# EAGLE design LED-RGB-shield_v1.1 (EAGLE 5.07)

## Sheet 1 of 2
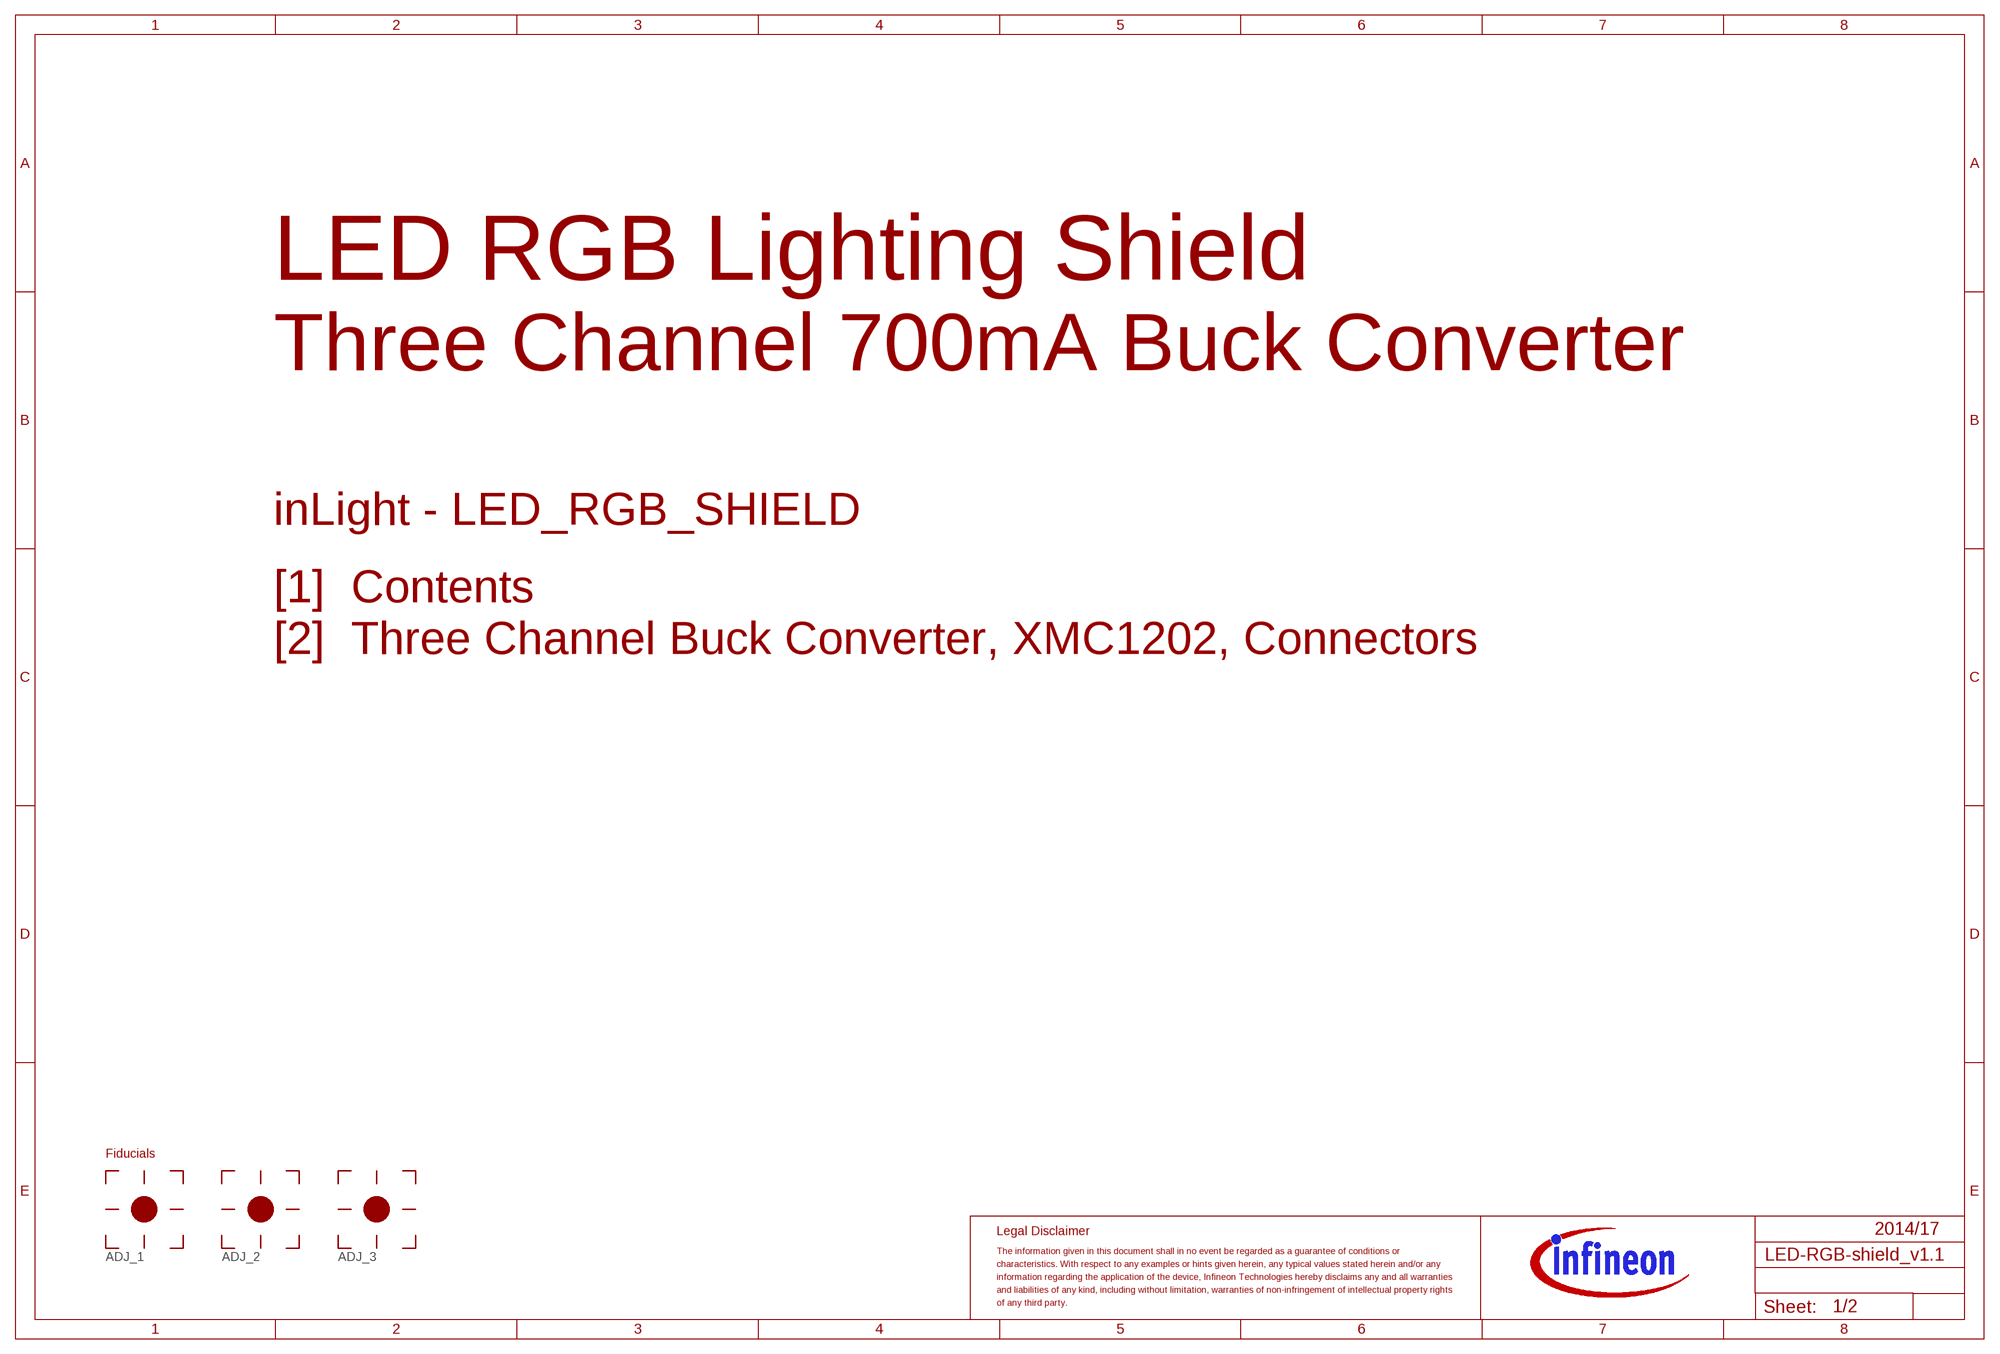
[diagram p0: schematic, sheet 1]

### Parts
ADJ_1  FIDUCIAL  [FIDUCIAL]
ADJ_2  FIDUCIAL  [FIDUCIAL]
ADJ_3  FIDUCIAL  [FIDUCIAL]
U1  INFINEONI3  [INFINEON_ICON_3]

### Notes on the sheet
- LED RGB Lighting Shield
- Three Channel 700mA Buck Converter
- inLight - LED_RGB_SHIELD
- [1]  Contents
- [2]  Three Channel Buck Converter, XMC1202, Connectors
- Fiducials
- 2014/17

## Sheet 2 of 2
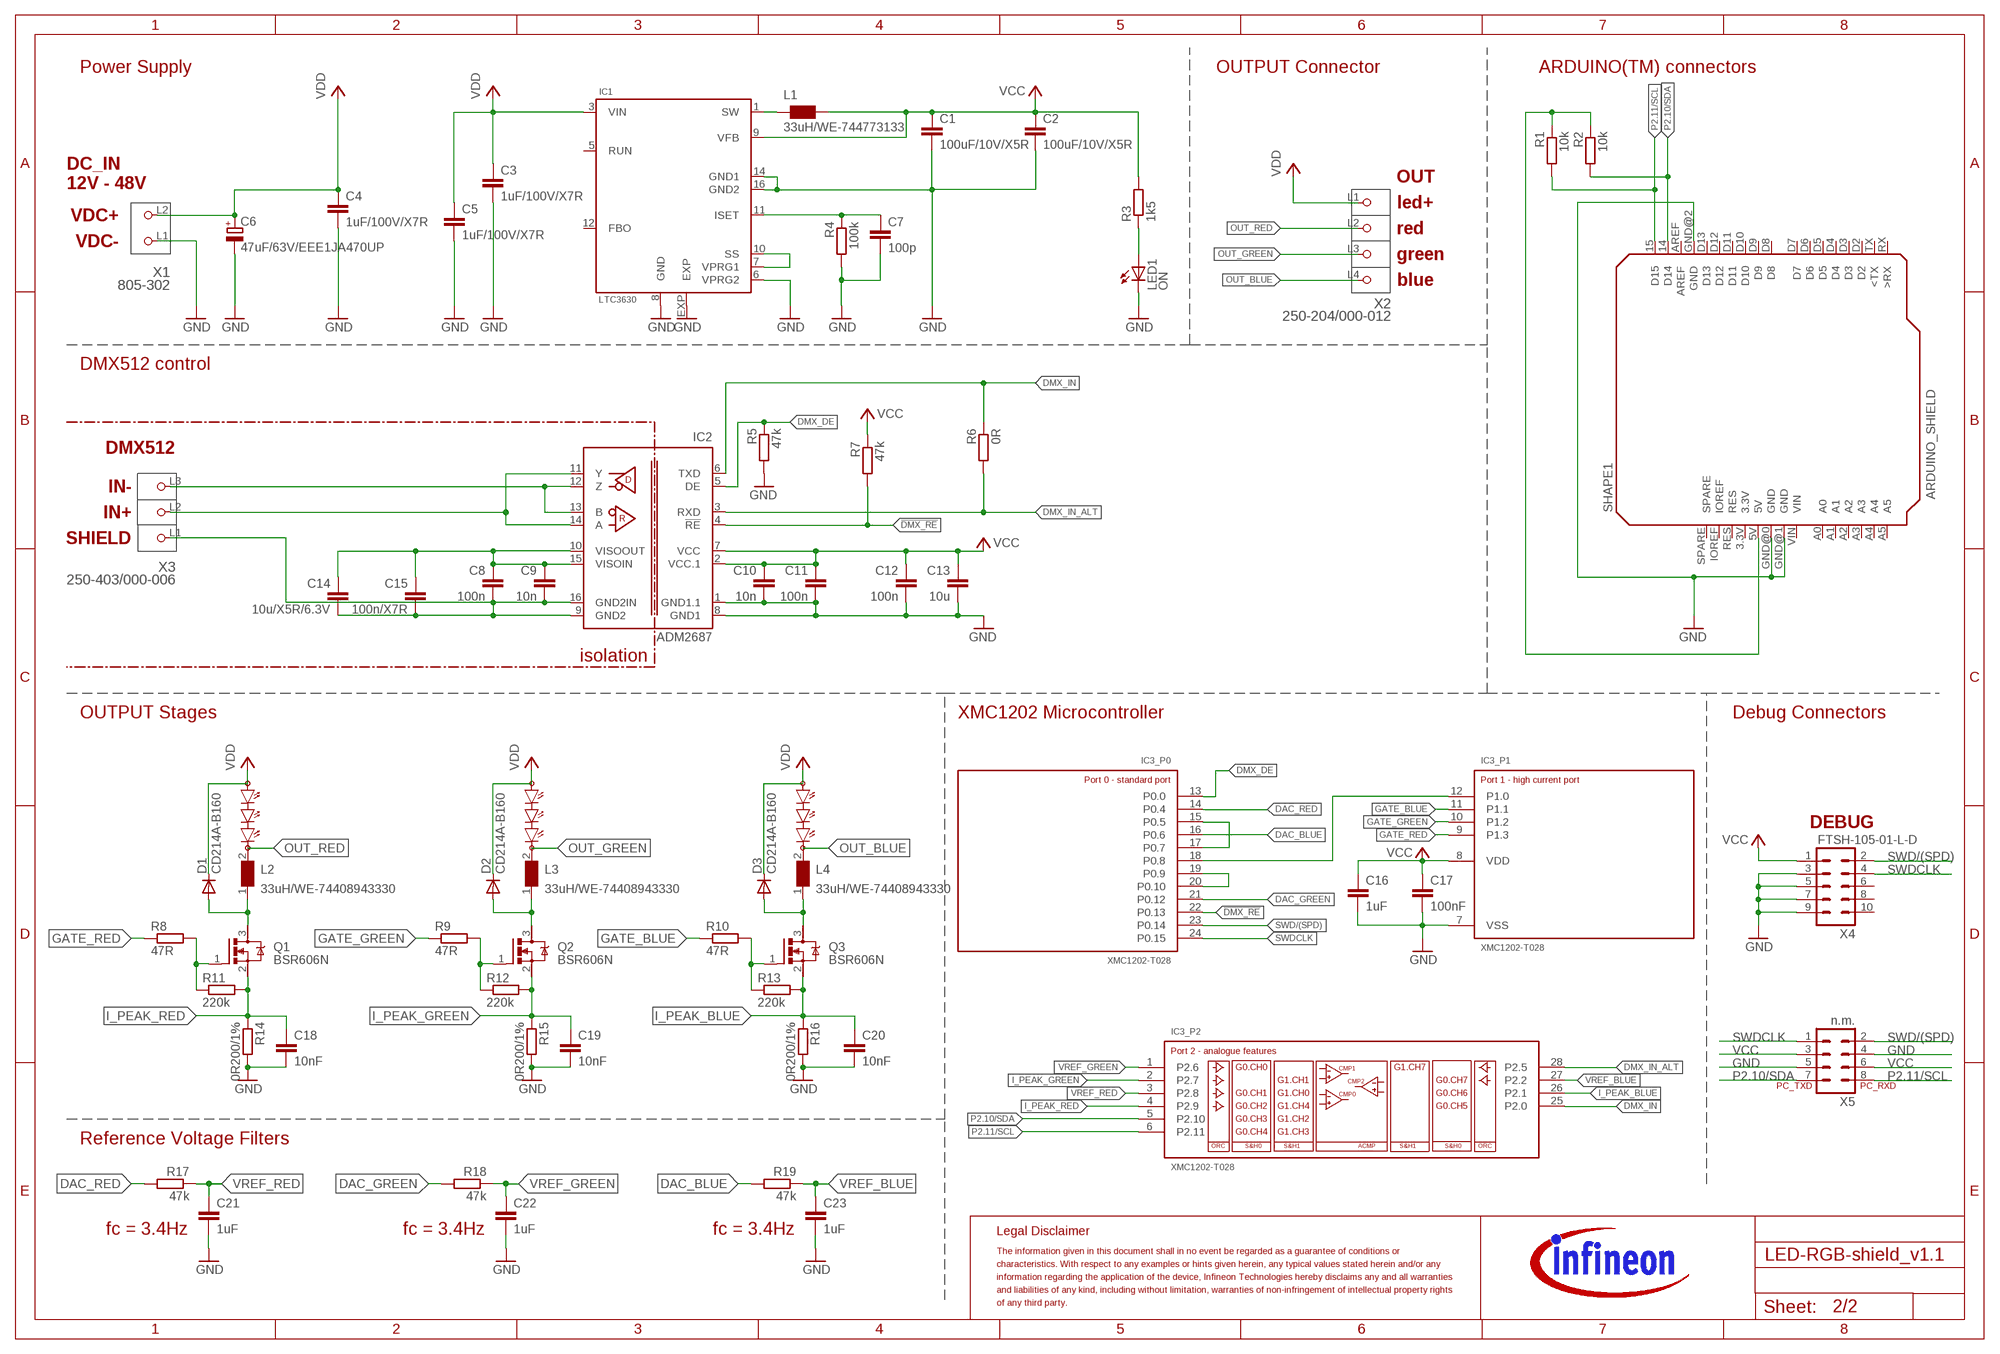
[diagram p1: schematic, sheet 2]

### Parts
C1  100uF/10V/X5R  C-EUC1206  [C1206]
C2  100uF/10V/X5R  C-EUC1206  [C1206]
C3  1uF/100V/X7R  C-EUC1206  [C1206]
C4  1uF/100V/X7R  C-EUC1206  [C1206]
C5  1uF/100V/X7R  C-EUC1206  [C1206]
C6  47uF/63V/EEE1JA470UP  CPOL-EUF  [PANASONIC_F]
C7  100p  C-EUC0603  [C0603]
C8  100n  C-EUC0603  [C0603]
C9  10n  C-EUC0603  [C0603]
C10  10n  C-EUC0603  [C0603]
C11  100n  C-EUC0603  [C0603]
C12  100n  C-EUC0603  [C0603]
C13  10u  C-EUC0603  [C0603]
C14  10u/X5R/6.3V  C-EUC0603  [C0603]
C15  100n/X7R  C-EUC0603  [C0603]
C16  1uF  C-EUC0603  [C0603]
C17  100nF  C-EUC0603  [C0603]
C18  10nF  C-EUC0603  [C0603]
C19  10nF  C-EUC0603  [C0603]
C20  10nF  C-EUC0603  [C0603]
C21  1uF  C-EUC0603  [C0603]
C22  1uF  C-EUC0603  [C0603]
C23  1uF  C-EUC0603  [C0603]
D1  CD214A-B160  DIODE-DO-214AC  [DO-214AC]
D2  CD214A-B160  DIODE-DO-214AC  [DO-214AC]
D3  CD214A-B160  DIODE-DO-214AC  [DO-214AC]
IC1  LTC3630  [MSE16(12)]
IC2  ADM2687  [SO-16W]
IC3  XMC1202-T028  XMC1000-T028  [P-TSSOP28-16]
L1  33uH/WE-744773133  WE-PD2_S  [WE-PD2_S]
L2  33uH/WE-74408943330  WE-SPC_48XX_4838/4828/4818  [WE-SPC_48XX]
L3  33uH/WE-74408943330  WE-SPC_48XX_4838/4828/4818  [WE-SPC_48XX]
L4  33uH/WE-74408943330  WE-SPC_48XX_4838/4828/4818  [WE-SPC_48XX]
LED1  ON  LEDCHIP-LED0603  [CHIP-LED0603]
Q1  BSR606N  [SC59]
Q2  BSR606N  [SC59]
Q3  BSR606N  [SC59]
R1  10k  R-EU_R0603  [R0603]
R2  10k  R-EU_R0603  [R0603]
R3  1k5  R-EU_R0603  [R0603]
R4  100k  R-EU_R0603  [R0603]
R5  47k  R-EU_R0603  [R0603]
R6  0R  R-EU_R0603  [R0603]
R7  47k  R-EU_R0603  [R0603]
R8  47R  R-EU_R0603  [R0603]
R9  47R  R-EU_R0603  [R0603]
R10  47R  R-EU_R0603  [R0603]
R11  220k  R-EU_R0603  [R0603]
R12  220k  R-EU_R0603  [R0603]
R13  220k  R-EU_R0603  [R0603]
R14  0R200/1%  R-EU_R0805  [R0805]
R15  0R200/1%  R-EU_R0805  [R0805]
R16  0R200/1%  R-EU_R0805  [R0805]
R17  47k  R-EU_R0603  [R0603]
R18  47k  R-EU_R0603  [R0603]
R19  47k  R-EU_R0603  [R0603]
SHAPE1  ARDUINO_SHIELD  [XMC1100_FOR_ARDUINO]
U2  INFINEONS5  [INFINEON_LOGO_5_SILK]
X1  805-302  [P-805-302]
X2  250-204/000-012  [P-250-204]
X3  250-403/000-006  [P-250-403]
X4  FTSH-105-01-L-D  FTSH-105-01-L-DV-THROUGHHOLE  [FTSH-105-01-L-DV-THROUGHHOLE]
X5  n.m.  MA04-2  [MA04-2]

### Nets
!DMX_RE: IC2.4(!RE) IC3.22(_P0:P0.13) R7.2
DAC_BLUE: IC3.16(_P0:P0.6) R19.2
DAC_GREEN: IC3.21(_P0:P0.12) R18.2
DAC_RED: IC3.14(_P0:P0.4) R17.2
DMX_DE: IC2.5(DE) IC3.13(_P0:P0.0) R5.1
DMX_IN: IC2.6(TXD) IC3.25(_P2:P2.0) R6.1
DMX_IN_ALT: IC2.3(RXD) IC3.28(_P2:P2.5) R6.2
GATE_BLUE: IC3.11(_P1:P1.1) R10.1
GATE_GREEN: IC3.10(_P1:P1.2) R9.1
GATE_RED: IC3.9(_P1:P1.3) R8.1
GND: C1.2 C2.2 C3.2 C4.2 C5.2 C6.- C7.2 C10.2 C11.2 C12.2 C13.2 C16.2 C17.2 C18.2 C19.2 C20.2 C21.2 C22.2 C23.2 IC1.6(VPRG2) IC1.8(GND) IC1.14(GND1) IC1.16(GND2) IC1.EXP IC2.1(GND1.1) IC2.8(GND1) IC3.7(_P1:VSS) LED1.C R4.2 R5.2 R14.2 R15.2 R16.2 SHAPE1.GND@0(GND) SHAPE1.GND@1(GND) SHAPE1.GND@2(GND) X1.L1(P1) X4.3 X4.5 X4.7 X4.9 X5.4 X5.5
I_PEAK_BLUE: C20.1 IC3.26(_P2:P2.1) Q3.2(S) R13.2 R16.1
I_PEAK_GREEN: C19.1 IC3.2(_P2:P2.7) Q2.2(S) R12.2 R15.1
I_PEAK_RED: C18.1 IC3.4(_P2:P2.9) Q1.2(S) R11.2 R14.1
N$1: D2.A L3.1 Q2.3(D)
N$2: D1.A L2.1 Q1.3(D)
N$3: IC3.15(_P0:P0.5) IC3.17(_P0:P0.7)
N$4: D3.A L4.1 Q3.3(D)
N$5: IC3.12(_P1:P1.0) IC3.18(_P0:P0.8)
N$6: IC3.19(_P0:P0.9) IC3.20(_P0:P0.10)
N$7: IC2.12(Z) IC2.13(B) X3.L3(P3)
N$8: IC2.11(Y) IC2.14(A) X3.L2(P2)
N$9: R1.1 R2.1 SHAPE1.5V
N$10: IC1.1(SW) L1.2
N$11: LED1.A R3.1
N$12: C8.1 C9.1 C14.1 C15.1 IC2.10(VISOOUT) IC2.15(VISOIN)
N$13: C7.1 IC1.11(ISET) R4.1
N$14: Q1.1(G) R8.2 R11.1
N$15: IC1.7(VPRG1) IC1.10(SS)
N$16: Q3.1(G) R10.2 R13.1
N$17: Q2.1(G) R9.2 R12.1
OUT_BLUE: L4.2 X2.L4(P4)
OUT_GREEN: L3.2 X2.L3(P3)
OUT_RED: L2.2 X2.L2(P2)
P2.10/SDA: IC3.5(_P2:P2.10) R2.2 SHAPE1.14(D14) X5.7
P2.11/SCL: IC3.6(_P2:P2.11) R1.2 SHAPE1.15(D15) X5.8
SHIELD: C8.2 C9.2 C14.2 C15.2 IC2.9(GND2) IC2.16(GND2IN) X3.L1(P1)
SWD/(SPD): IC3.23(_P0:P0.14) X4.2 X5.2
SWDCLK: IC3.24(_P0:P0.15) X4.4 X5.1
VCC: C1.1 C2.1 C10.1 C11.1 C12.1 C13.1 C16.1 C17.1 IC1.9(VFB) IC2.2(VCC.1) IC2.7(VCC) IC3.8(_P1:VDD) L1.1 R3.2 R7.1 X4.1 X5.3 X5.6
VDD: C3.1 C4.1 C5.1 C6.+ D1.C D2.C D3.C IC1.3(VIN) X1.L2(P2) X2.L1(P1)
VREF_BLUE: C23.1 IC3.27(_P2:P2.2) R19.1
VREF_GREEN: C22.1 IC3.1(_P2:P2.6) R18.1
VREF_RED: C21.1 IC3.3(_P2:P2.8) R17.1
Unconnected: SHAPE1.3.3V SHAPE1.A0 SHAPE1.A1 SHAPE1.A2 SHAPE1.A3 SHAPE1.A4 SHAPE1.A5 SHAPE1.AREF SHAPE1.D2 SHAPE1.D3 SHAPE1.D4 SHAPE1.D5 SHAPE1.D6 SHAPE1.D7 SHAPE1.D8 SHAPE1.D9 SHAPE1.D10 SHAPE1.D11 SHAPE1.D12 SHAPE1.D13 SHAPE1.IOREF SHAPE1.RES SHAPE1.RX(>RX) SHAPE1.SPARE SHAPE1.TX(<TX) SHAPE1.VIN X4.6 X4.8 X4.10

### Notes on the sheet
- Power Supply | OUTPUT Connector | ARDUINO(TM) connectors
- DC_IN
- OUT
- 12V - 48V
- VDC+ | led+
- VDC- | red
- green
- blue
- DMX512 control
- DMX512
- IN-
- IN+
- SHIELD
- isolation
- OUTPUT Stages | XMC1202 Microcontroller | Debug Connectors
- DEBUG
- PC_TXD | PC_RXD
- Reference Voltage Filters
- fc = 3.4Hz | fc = 3.4Hz | fc = 3.4Hz

## Power pins joined to a net without a drawn wire
FBO: IC1.12(FBO)
RUN: IC1.5(RUN)

## Library data of the parts
ADJ_1-ADJ_3 = Global:FIDUCIAL: Fiducial FIDUCIAL: Durchmesser = 0.75mm Kupfer und 1.5mm Lötstopmaske FIDUCIAL 0.5mm: Durchmesser= 0.5mm Kupfer und 1.0mm Lötstopmaske
C1-C5 C7-C23 = rcl:C-EU: CAPACITOR, European symbol
C6 = rcl:CPOL-EU: POLARIZED CAPACITOR, European symbol
D1-D3 = diode:DIODE-: DIODE
IC1 = LinearTechnology:LTC3630
IC2 = AnalogDevice:ADM2687: Triple-Channel Digital Isolators Source: http://www.analog.com/static/imported-files/data_sheets/ADuM1300_1301.pdf
IC3 = XMC1000:XMC1000-T028
L1 = wuerth-elektronik:WE-PD2: SMD-Power Inductors WE-PD2 Is recommended for the application with switching regulators from National Semiconductor, Linear Technology, Texas Instruments and Fairchild Semiconductor -- Switching regulators with low operating voltages (computer, laptop, mobile phones, pagers) -- Integrated DC/DC-converter
L2-L4 = PowerMagnetics:WE-SPC_48XX: SMD-Shielded Power Inductor WE-SPC
LED1 = led:LED: LED OSRAM: - CHIPLED LG R971, LG N971, LY N971, LG Q971, LY Q971, LO R971, LY R971 LH N974, LH R974 LS Q976, LO Q976, LY Q976 LO Q996 - Hyper CHIPLED LW Q18S LB Q993, LB Q99A, LB R99A - SideLED LS A670, LO A670, LY A670, LG A670, LP A670 LB A673, LV A673, LT A673, LW A673 LH A674 LY A675 LS A676, LA A676, LO A676, LY A676, LW A676 LS A679, LY A679, LG A679 - Hyper Micro SIDELED® LS Y876, LA Y876, LO Y876, LY Y876 LT Y87S - SmartLED LW L88C, LW L88S LB L89C, LB L89S, LG L890 LS L89K, LO L89K, LY L89K LS L896, LA L896, LO L896, LY L896 - TOPLED LS T670, LO T670, LY T670, LG T670, LP T670 LSG T670, LSP T670, LSY T670, LOP T670, LYG T670 LG T671, LOG T671, LSG T671 LB T673, LV T673, LT T673, LW T673 LH T674 LS T676, LA T676, LO T676, LY T676, LB T676, LH T676, LSB T676, LW T676 LB T67C, LV T67C, LT T67C, LS T67K, LO T67K, LY T67K, LW E67C LS E67B, LA E67B, LO E67B, LY E67B, LB E67C, LV E67C, LT E67C LW T67C LS T679, LY T679, LG T679 LS T770, LO T770, LY T770, LG T770, LP T770 LB T773, LV T773, LT T773, LW T773 LH T774 LS E675, LA E675, LY E675, LS T675 LS T776, LA T776, LO T776, LY T776, LB T776 LHGB T686 LT T68C, LB T68C - Hyper Mini TOPLED® LB M676 - Mini TOPLED Santana® LG M470 LS M47K, LO M47K, LY M47K Source: http://www.osram.convergy.de LUXEON: - LUMILED® LXK2-PW12-R00, LXK2-PW12-S00, LXK2-PW14-U00, LXK2-PW14-V00 LXK2-PM12-R00, LXK2-PM12-S00, LXK2-PM14-U00 LXK2-PE12-Q00, LXK2-PE12-R00, LXK2-PE12-S00, LXK2-PE14-T00, LXK2-PE14-U00 LXK2-PB12-K00, LXK2-PB12-L00, LXK2-PB12-M00, LXK2-PB14-N00, LXK2-PB14-P00, LXK2-PB14-Q00 LXK2-PR12-L00, LXK2-PR12-M00, LXK2-PR14-Q00, LXK2-PR14-R00 LXK2-PD12-Q00, LXK2-PD12-R00, LXK2-PD12-S00 LXK2-PH12-R00, LXK2-PH12-S00 LXK2-PL12-P00, LXK2-PL12-Q00, LXK2-PL12-R00 Source: www.luxeon.com KINGBRIGHT: KA-3528ASYC Source: www.kingbright.com
Q1-Q3 = infineon_discrete:BSR606N
R1-R19 = rcl:R-EU_: RESISTOR, European symbol
SHAPE1 = arduino:ARDUINO_SHIELD
U1 U2 = infineon_logo:INFINEON
X1 = con-wago_805:805-302: Serie 805, Klemmenleiste für Leiterplatten 1 Lötstift/Pol versetzt / Series 805, PCB terminal strip 1 solder pin/pole, staggered Polzahl / Pole No.: 2 Bemessungsspannung / Rated Voltage: 320 V Nennstrom / Nominal Current: 17.5 A Leiterquerschnitt / Conductor Size: 0.2 - 1.5 mm² Anschlusstechnik / Connection Technology: CAGE CLAMP® S Lötstiftlänge: / Solder Pin Length: 3.2 mm Leitereinführung (zur Platine) / Conductor entry angle (to PCB): 0 ° Farbe / Color: grau / gray Stand: 01.01.2012. Die jeweils aktuellen Daten zu diesem Artikel finden Sie in unserem Produktkatalog, den Sie unter www.wago.com einsehen können. As of: 01/01/2012. Please find the newest data for this article in our product catalogue, which can be viewed under www.wago.com.
X2 = con-wago_250:250-204/000-012: Serie 250, 1-Leiter-Klemmenleiste für Leiterplatten 1 Lötstift/Pol versetzt / Series 250, 1-conductor PCB terminal strip 1 solder pin/pole, staggered Polzahl / Pole No.: 4 Rastermaß / Pitch: 3.5 mm Bemessungsspannung / Rated Voltage: 320 V Nennstrom / Nominal Current: 8 A Leiterquerschnitt / Conductor Size: 0.2 - 1.5 mm² Anschlusstechnik / Connection Technology: Steckklemm-Anschluss Lötstiftlänge: / Solder Pin Length: 3.6 mm Leitereinführung (zur Platine) / Conductor entry angle (to PCB): 45 ° Farbe / Color: orange / orange Stand: 01.01.2012. Die jeweils aktuellen Daten zu diesem Artikel finden Sie in unserem Produktkatalog, den Sie unter www.wago.com einsehen können. As of: 01/01/2012. Please find the newest data for this article in our product catalogue, which can be viewed under www.wago.com.
X3 = con-wago_250:250-403/000-006: Serie 250, 1-Leiter-Klemmenleiste für Leiterplatten 1 Lötstift/Pol versetzt / Series 250, 1-conductor PCB terminal strip 1 solder pin/pole, staggered Polzahl / Pole No.: 3 Rastermaß / Pitch: 2.5 mm Bemessungsspannung / Rated Voltage: 160 V Nennstrom / Nominal Current: 4 A Leiterquerschnitt / Conductor Size: 0.14 - 0.5 mm² Lötstiftlänge: / Solder Pin Length: 3.6 mm Leitereinführung (zur Platine) / Conductor entry angle (to PCB): 45 ° Farbe / Color: blau / blue Stand: 01.01.2012. Die jeweils aktuellen Daten zu diesem Artikel finden Sie in unserem Produktkatalog, den Sie unter www.wago.com einsehen können. As of: 01/01/2012. Please find the newest data for this article in our product catalogue, which can be viewed under www.wago.com.
X4 = TIMM1:FTSH-105-01-L-DV-THROUGHHOLE
X5 = con-lstb:MA04-2: PIN HEADER

## Net classes
1 ground: clearance 0.381 mm
2 Meas_analog: width 0.2 mm, drill 0.2 mm, clearance 2 mm to class 1, clearance 0.2 mm
6 LV: clearance 0.2 mm to class 0, clearance 2 mm to class 1, clearance 0.2 mm to class 2, clearance 2 mm to class 3, clearance 2 mm to class 4, clearance 1 mm to class 5, clearance 0.2 mm

## Board
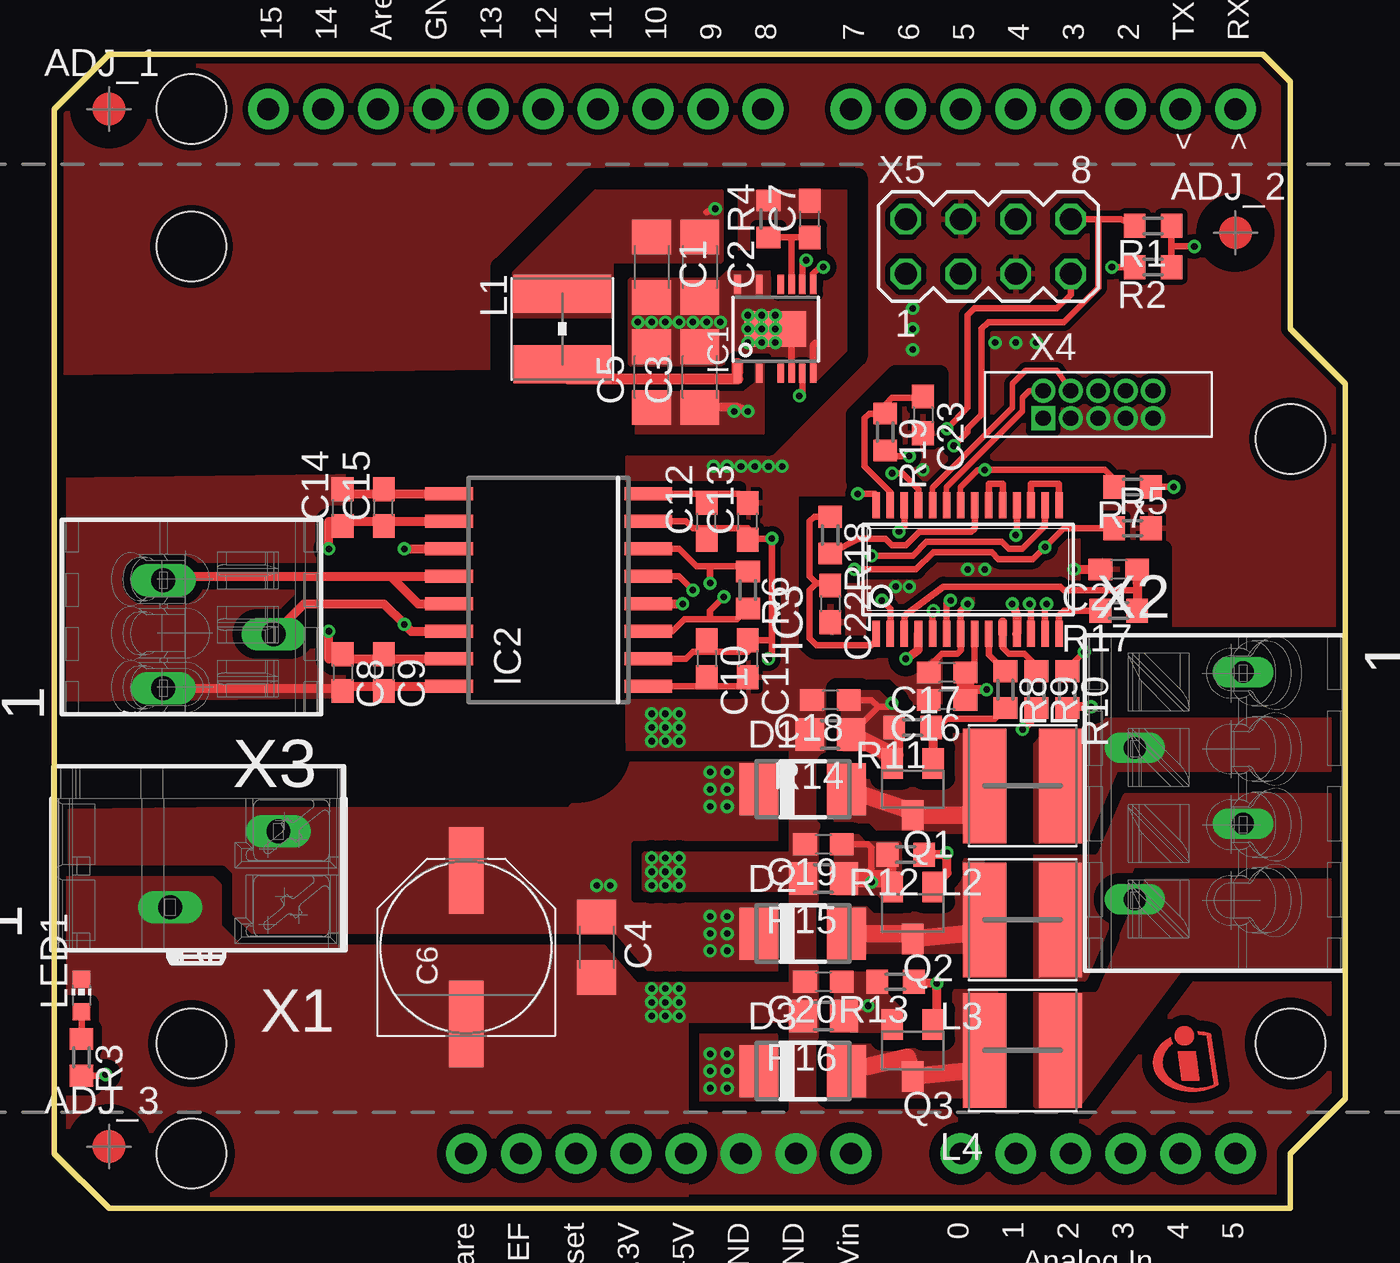
[diagram p2: board, top side]
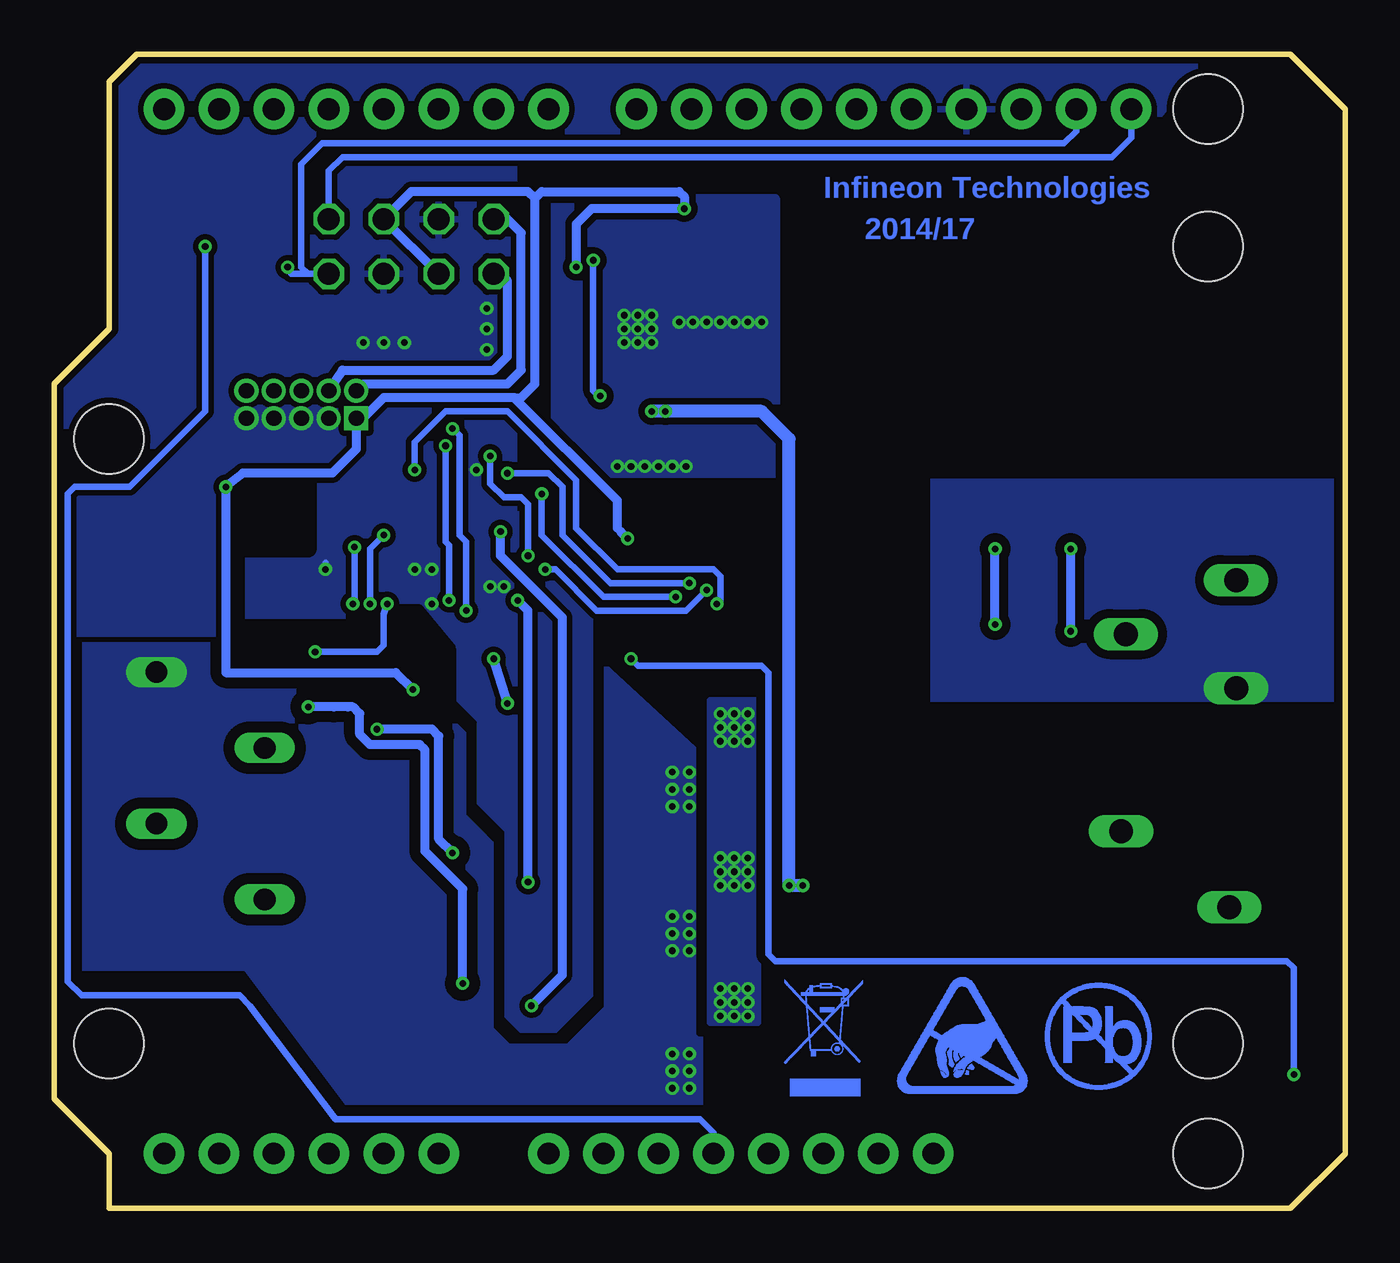
[diagram p3: board, bottom side, seen from below]

Size 59.69 x 53.34 mm. Coordinates in mm from the lower left corner, seen from the top.
Copper layers (1*16): Top 0.035mm / dielectric 1.5mm / Bottom 0.035mm
Design rules "PCB-POOL Standard *": minimum track width 0.15mm, minimum drill 0.3mm, track to track 0.15mm, track to pad 0.15mm, pad to pad 0.15mm, via to via 0.15mm, smd to smd 0.15mm, copper to edge 0.3mm, drill to drill 0.2mm, minimum pad ring 0.2mm, minimum via ring 0.15mm, stop-mask expansion 0.075mm, vias tented up to drill 12mil, thermal gap 0.2mm
Holes 3.2 mm at 6.35,7.62 6.35,44.45
tRestrict: area 26.7,23.8 to 31.8,33.3; 23 lines
bRestrict: 9 lines

### Footprints (pad centres in the part's own frame; a part is rotated, then mirrored left to right if it is on the bottom)
C1206 = smd 1.6 x 1.8: 1 -1.4,0; 2 1.4,0
PANASONIC_F = smd 4 x 1.6: + 3.55,0; - -3.55,0
C0603 = smd 1.1 x 1: 1 -0.85,0; 2 0.85,0
DO-214AC = smd 1.8 x 2.4: A 2.025,0; C -2.025,0
MSE16(12) = smd 0.305 x 0.889: 1 -1.75,-2.05; 3 -0.75,-2.05; 5 0.25,-2.05; 6 0.75,-2.05; 7 1.25,-2.05; 8 1.75,-2.05; 9 1.75,2.05; 10 1.25,2.05; 11 0.75,2.05; 12 0.25,2.05; 14 -0.75,2.05; 16 -1.75,2.05 | smd 2.845 x 1.651: EXP 0,0
SO-16W = smd 0.6 x 2.2: 1 -4.445,-4.6; 2 -3.175,-4.6; 3 -1.905,-4.6; 4 -0.635,-4.6; 5 0.635,-4.6; 6 1.905,-4.6; 7 3.175,-4.6; 8 4.445,-4.6; 9 4.445,4.6; 10 3.175,4.6; 11 1.905,4.6; 12 0.635,4.6; 13 -0.635,4.6; 14 -1.905,4.6; 15 -3.175,4.6; 16 -4.445,4.6
P-TSSOP28-16 = smd 1.2 x 0.35: 1 -2.975,4.225; 2 -2.975,3.575; 3 -2.975,2.925; 4 -2.975,2.275; 5 -2.975,1.625; 6 -2.975,0.975; 7 -2.975,0.325; 8 -2.975,-0.325; 9 -2.975,-0.975; 10 -2.975,-1.625; 11 -2.975,-2.275; 12 -2.975,-2.925; 13 -2.975,-3.575; 14 -2.975,-4.225; 15 2.975,-4.225; 16 2.975,-3.575; 17 2.975,-2.925; 18 2.975,-2.275; 19 2.975,-1.625; 20 2.975,-0.975; 21 2.975,-0.325; 22 2.975,0.325; 23 2.975,0.975; 24 2.975,1.625; 25 2.975,2.275; 26 2.975,2.925; 27 2.975,3.575; 28 2.975,4.225
WE-PD2_S = smd 1.75 x 4.5: 1 -1.625,0; 2 1.625,0
WE-SPC_48XX = smd 2 x 5.3: 1 -1.75,0; 2 1.75,0
CHIP-LED0603 = smd 0.8 x 0.8: A 0,-0.75; C 0,0.75
SC59 = smd 1 x 1.4: 1 -0.95,-1.2; 2 0.95,-1.2; 3 0,1.2
R0603 = smd 1 x 1.1: 1 -0.85,0; 2 0.85,0
R0805 = smd 1.3 x 1.5: 1 -0.95,0; 2 0.95,0
XMC1100_FOR_ARDUINO = drill 1.016 pad 1.88 round: 3.3V 26.67,2.54; 5V 29.21,2.54; 14 12.446,50.8; 15 9.906,50.8; A0 41.91,2.54; A1 44.45,2.54; A2 46.99,2.54; A3 49.53,2.54; A4 52.07,2.54; A5 54.61,2.54; AREF 14.986,50.8; D2 49.53,50.8; D3 46.99,50.8; D4 44.45,50.8; D5 41.91,50.8; D6 39.37,50.8; D7 36.83,50.8; D8 32.766,50.8; D9 30.226,50.8; D10 27.686,50.8; D11 25.146,50.8; D12 22.606,50.8; D13 20.066,50.8; GND@0 31.75,2.54; GND@1 34.29,2.54; GND@2 17.526,50.8; IOREF 21.59,2.54; RES 24.13,2.54; RX 54.61,50.8; SPARE 19.05,2.54; TX 52.07,50.8; VIN 36.83,2.54 | hole 3.2: 57.15,35.56; 57.15,7.62; 6.35,50.8; 6.35,2.54
P-805-302 = drill 1.1 long: L1 1.3,1.95; L2 -3.7,-1.55
P-250-204 = drill 1 long: L1 1.3,6.05; L2 -3.7,2.55; L3 1.3,-0.95; L4 -3.7,-4.45
P-250-403 = drill 1.1 long: L1 1.3,3.271; L2 -3.8,0.771; L3 1.3,-1.729
FTSH-105-01-L-DV-THROUGHHOLE = drill 0.71 pad 0.889 square: 1 0,0 | drill 0.71 pad 0.889 round: 2 0,1.27; 3 1.27,0; 4 1.27,1.27; 5 2.54,0; 7 3.81,0; 8 3.81,1.27; 9 5.08,0; 10 5.08,1.27 | drill 0.7 pad 0.889 round: 6 2.54,1.27
MA04-2 = drill 1.016 octagon: 1 -3.81,-1.27; 2 -3.81,1.27; 3 -1.27,-1.27; 4 -1.27,1.27; 5 1.27,-1.27; 6 1.27,1.27; 7 3.81,-1.27; 8 3.81,1.27

### Placement (x,y rotation side)
ADJ_1  2.54,50.8 0 top
ADJ_2  54.61,45.09 0 top
ADJ_3  2.54,2.86 0 top
C1  27.62,43.5 270 top
C2  29.84,43.5 270 top
C3  29.84,38.42 90 top
C4  25.08,12.06 270 top
C5  27.62,38.42 90 top
C6  19.05,12.06 90 top
C7  34.92,45.72 90 top
C8  13.34,24.77 270 top
C9  15.24,24.77 270 top
C10  30.16,25.4 270 top
C11  32.07,25.4 270 top
C12  30.16,31.75 90 top
C13  32.07,31.75 90 top
C14  13.34,32.38 90 top
C15  15.24,32.38 90 top
C16  41.27,23.5 180 top
C17  41.27,24.77 180 top
C18  35.88,23.5 180 top
C19  35.56,16.83 180 top
C20  35.56,10.48 180 top
C21  49.21,29.53 180 top
C22  35.88,27.94 270 top
C23  40.16,36.67 270 top
D1  34.61,19.37 0 top
D2  34.61,12.7 0 top
D3  34.61,6.35 0 top
IC1  33.34,40.64 0 top
IC2  22.86,28.57 90 top
IC3  42.23,29.53 90 top
L1  23.5,40.64 270 top
L2  44.77,19.53 0 top
L3  44.77,13.34 0 top
L4  44.77,7.3 0 top
LED1  1.27,9.84 0 top
Q1  39.69,19.37 180 top
Q2  39.69,13.65 180 top
Q3  39.69,7.3 180 top
R1  50.8,45.4 180 top
R2  50.8,43.5 180 top
R3  1.27,6.99 270 top
R4  33.02,45.72 90 top
R5  49.85,31.43 0 top
R6  32.07,28.57 270 top
R7  49.85,33.34 180 top
R8  43.97,23.97 270 top
R9  45.4,23.97 270 top
R10  46.83,23.97 270 top
R11  39.69,22.23 180 top
R12  39.37,16.35 180 top
R13  38.89,10.48 180 top
R14  35.88,21.91 180 top
R15  35.56,15.24 180 top
R16  35.56,8.89 180 top
R17  49.21,27.62 180 top
R18  35.88,31.11 270 top
R19  38.42,35.88 270 top
SHAPE1  0,0 0 top
U1  50.8,5.4 0 top
U2  8.26,42.55 0 top
U$8  [BIN]  24.13,8.57 0 top
U$9  [ESD]  17.78,7.3 0 top
U$10  [NOPB]  11.43,7.94 0 top
X1  6.67,15.88 180 top
X2  53.66,18.73 0 top
X3  6.35,27.3 180 top
X4  45.72,36.51 0 top
X5  43.18,44.45 0 top

### Tracks (layer width: path | path; a pad name or v marks a point on that pad's centre or on a via)
!DMX_RE  (via drill 0.3)
  Top 0.254: IC3.22 41.9,33.33 42.7,34.13 v43.02,34.13
  Top 0.305: R7.2 48.9,33.81 48.58,34.13 v43.02,34.13
  Top 0.406: IC2.4 v29.05,27.94
  Bottom 0.305: v43.02,34.13 43.02,35.08 43.02,35.4 41.59,36.83 38.73,36.83 35.56,33.66 35.56,31.43 33.66,29.53 29.21,29.53 28.89,29.21 28.89,28.1 v29.05,27.94
DAC_BLUE  (via drill 0.3)
  Top 0.305: IC3.16 45.8,31.52 44.77,30.48 44.13,30.48 43.81,30.8 40.32,30.8 39.69,30.16 v37.78,30.16 | R19.2 38.68,34.77 v39.53,34.77
  Bottom 0.305: v39.53,34.77 39.53,33.5 38.89,32.86 38.1,32.86 37.78,32.54 v37.78,30.16
DAC_GREEN
  Top 0.305: IC3.21 42.55,31.44 42.39,31.27 40.01,31.27 39.37,30.64 38.73,30.64 38.42,30.96 37.2,30.96 R18.2
DAC_RED
  Top 0.305: IC3.14 46.45,27.4 46.67,27.62 R17.2
DMX_DE  (via drill 0.3)
  Top 0.305: 45.24,30 43.66,30 43.34,30.32 40.64,30.32 39.85,29.53 v36.99,29.53 | v29.53,28.57 28.89,29.21 IC2.5 | 45.24,30 v45.8,30.56 | R5.1 46.67,31.43 45.24,30 | v45.88,27.94 45.8,27.86 IC3.13
  Bottom 0.305: v36.99,29.53 36.51,29.53 34.61,27.62 30.48,27.62 v29.53,28.57 | v45.8,30.56 45.8,28.02 v45.88,27.94
DMX_IN  (via drill 0.3)
  Top 0.305: IC3.25 39.95,33.23 39.79,33.39 39.21,33.97 v38.73,33.97 | IC2.6 28.89,30.48 29.69,29.69 30.32,29.69 | R6.1 31.81,29.69 30.32,29.69 | 30.32,29.69 v30.32,28.89
  Bottom 0.305: v38.73,33.97 36.83,33.97 36.2,33.34 36.2,31.11 33.97,28.89 v30.32,28.89
DMX_IN_ALT  (via drill 0.3)
  Top 0.305: IC3.28 38,32.96 37.94,33.02 v37.15,33.02 | IC2.3 28.57,26.67 29.13,27.23 30.32,27.23 | R6.2 31.57,27.23 30.32,27.23 | v30.96,28.26 30.32,27.62 30.32,27.23
  Bottom 0.305: v37.15,33.02 37.15,31.11 34.29,28.26 v30.96,28.26
GATE_BLUE  (via drill 0.3)
  Top 0.305: R10.1 46.73,24.82 v47.62,25.72
  Top 0.406: v44.29,27.94 44.5,27.41 IC3.11
  Bottom 0.305: v47.62,25.72 44.77,25.72 44.45,26.04 44.45,27.46 v44.29,27.94
GATE_GREEN
  Top 0.305: R9.1 45.24,25.24 44.85,25.64 44.13,25.64 43.85,25.92 IC3.10
  Top 0.406: IC3.10 43.85,27.11
GATE_RED
  Top 0.305: IC3.9 43.2,25.59 R8.1
GND  (via drill 0.3)
  Top 0.305: C17.2 40.64,24.77 40.64,25.24 41.04,25.64 41.75,25.64 41.91,25.8 IC3.7 41.9,27.61 v42.23,27.94 | IC2.1 30.16,24.13 | 30.16,24.13 31.65,24.13 C11.2 | 30.16,24.13 C10.2 | 30.16,33.02 IC2.8 | 30.16,33.02 31.65,33.02 C13.2 | C12.2 30.16,33.02 | IC1.6 34.09,40.52 arc90 33.97,40.64 | IC1.8 35.09,39.85 arc-90 35.24,40.01
  Top 0.406: v47.15,29.53 C21.2
  Bottom 0.305: v47.15,29.53 47.15,29.84
  other vias: 39.53,28.73 26.99,40.96 27.62,40.96 28.26,40.96 28.89,40.96 29.53,40.96 30.16,40.96 30.8,40.96 32.07,41.27 32.07,40.64 32.7,40.64 32.7,41.27 33.34,41.27 33.34,40.64 32.07,40.01 32.7,40.01 33.34,40.01 30.48,34.29 31.11,34.29 31.75,34.29 32.38,34.29 33.02,34.29 33.66,34.29 27.62,10.16 28.26,10.16 28.89,10.16 28.89,9.53 28.26,9.53 27.62,9.53 27.62,8.89 28.26,8.89 28.89,8.89 27.62,22.86 28.26,22.86 28.89,22.86 28.89,22.23 28.26,22.23 27.62,22.23 27.62,21.59 28.26,21.59 28.89,21.59 27.62,16.19 28.26,16.19 28.89,16.19 28.89,15.56 28.26,15.56 27.62,15.56 27.62,14.92 28.26,14.92 28.89,14.92 39.69,39.69 39.69,40.64 39.69,41.59 45.4,40.01 43.5,40.01 44.45,40.01 40.16,34.13 42.23,29.53 43.02,29.53 38.89,28.73
  pour Top (isolate 0.406, rank 3, no thermals): 0,15.24 7.3,15.24 7.62,14.92 7.62,13.02 8.57,12.06 25.4,12.06 27.3,9.84 29.21,9.84 29.21,-0.64 0,-0.64
  pour Top (isolate 0.508, rank 6, no thermals): 33.97,25.72 33.97,5.08 26.35,5.08 26.35,-0.32 60.64,-0.32 60.64,10.48 51.44,10.48 47.31,5.08 35.56,5.08 35.56,22.54 46.99,22.54 46.99,25.72
  pour Bottom (isolate 0.254): 34.92,31.11 34.92,9.84 36.51,8.26 38.1,8.26 38.73,8.89 38.73,17.46 40.01,18.73 40.01,22.54 40.96,23.5 40.96,27.3 47.31,27.3 47.31,31.11 46.35,32.07 35.88,32.07
  pour Top (isolate 0.305, rank 6): 35.56,31.11 36.51,32.07 46.67,32.07 47.31,31.43 47.31,26.67 46.67,26.04 36.51,26.04 35.56,26.99
  pour Top (isolate 0.254, rank 4): 34.29,21.27 34.29,33.02 48.58,33.02 48.58,26.67 48.9,26.99 59.69,26.99 59.69,53.34 0,53.34 0,38.1 20.32,38.1 20.32,43.18 25.4,48.26 37.15,48.26 37.15,39.37 33.02,35.24 0,35.24 0,19.05 23.81,19.05 25.72,21.27
  pour Top (isolate 0.305, rank 2, no thermals): 26.67,39.05 26.67,42.86 30.8,42.86 31.75,43.81 31.75,46.99 37.15,46.99 37.15,35.56 33.34,35.56 33.34,39.37 31.43,39.37 30.8,39.05
  pour Bottom (isolate 0.305): 26.35,46.67 26.35,35.88 35.88,35.88 36.51,36.51 36.51,46.67
  pour Bottom (isolate 0.305): 26.04,36.2 36.83,36.2 36.83,33.97 26.04,33.97
  pour Top (isolate 0.305, no thermals): 34.29,16.35 27.3,16.35 27.3,14.76 34.29,14.76
  pour Top (isolate 0.508, no thermals): 34.29,10.32 26.35,10.32 26.35,8.73 34.29,8.73
  pour Top (isolate 0.508, no thermals): 34.61,16.35 27.62,16.35 27.62,14.76 34.61,14.76
  pour Bottom (isolate 0.406, no thermals): 27.15,23.5 27.15,8.57 29.37,8.57 29.37,23.5
  pour Bottom (isolate 0.254, rank 6): 10.16,48.58 6.35,53.34 60.96,53.34 60.96,26.35 45.72,26.67 45.09,26.04 38.42,26.04 38.42,48.58
I_PEAK_BLUE  (via drill 0.3)
  Top 0.305: v39.05,31.27 39.3,31.52 IC3.26 | R13.2 38.42,10.79 | v37.62,9.37 37.78,9.53 R16.1 | C20.1 36.51,10.48
  Bottom 0.406: v37.62,9.37 37.47,9.53 36.2,10.79 36.2,27.3 39.05,30.16 39.05,30.96 v39.05,31.27
  pour Top (no thermals): 36.2,10.48 36.2,8.89 36.83,8.26 39.05,8.26 39.05,9.21 38.42,9.84 38.42,10.79 36.2,10.79
I_PEAK_GREEN  (via drill 0.3)
  Top 0.305: IC3.2 38.65,27.7 v38.26,28.1 | 38.73,16.51 R12.2 | v37.78,15.08 37.78,15.24 | C19.1 37.62,16.83 37.78,16.67 37.78,15.72 37.31,15.24
  Top 0.406: 38.74,15.24 38.73,15.24 38.73,16.51 | 38.73,16.51 | 38.73,16.51 38.73,16.67
  Top 0.813: R15.1 37.31,15.24 37.78,15.24 38.74,15.24 Q2.2
  Bottom 0.406: v37.78,15.08 37.78,27.62 v38.26,28.1
  pour Top (no thermals): 36.2,17.14 37.15,17.14 37.47,16.83 39.05,16.83 39.05,14.29 38.42,14.29 38.1,14.61 36.2,14.61
I_PEAK_RED  (via drill 0.3)
  Top 0.305: 38.1,23.18 38.58,23.18 v38.73,23.34 | v38.73,23.34 | 38.1,23.18 37.78,22.86 R14.1 | 39.05,22.23 R11.2 | C18.1 37.78,23.5 38.1,23.18
  Top 0.406: 38.74,20.95 39.05,20.95 39.05,22.23 39.05,22.54 | v39.37,25.4 39.95,25.82 IC3.4
  Top 0.813: R14.1 38.74,20.95 Q1.2
  Bottom 0.406: v38.73,23.34 v39.37,25.4
  pour Top (no thermals): 36.51,23.81 38.1,23.81 39.05,22.86 39.05,20.32 38.42,20.32 38.42,20.64 37.78,21.27 36.51,21.27
N$1
  Top 0.813: D2.A 39.44,12.7 Q2.3 42.79,12.77 42.86,12.7 42.86,14.25
  pour Top (isolate 0.508, rank 2, no thermals): 36.51,14.29 40.96,14.29 40.96,16.03 42.86,16.03 42.86,11.91 36.51,11.91
N$2
  Top 0.813: D1.A 39.44,18.41 Q1.3 42.79,18.17 42.86,18.1 42.86,19.65
  pour Top (isolate 0.508, rank 2, no thermals): 36.2,19.68 40.64,19.68 40.64,22.38 42.55,22.38 42.55,17.94 42.7,17.94 42.23,17.46 36.2,17.46
N$3
  Top 0.305: IC3.17 45.15,33.5 46.45,33.5 IC3.15
N$4
  Top 0.813: D3.A 39.44,6.99 Q3.3 42.79,6.42 42.86,6.67 42.86,8.22
  pour Top (isolate 0.508, rank 2, no thermals): 36.2,8.26 40.64,8.26 40.64,10 43.5,10 43.5,5.24 36.2,5.24
N$5  (via drill 0.3)
  Top 0.305: v44.45,31.11 44.5,31.17 IC3.18 | IC3.12 45.15,27.94 v45.09,27.94
  Bottom 0.305: v45.09,27.94 45.09,30.48 v44.45,31.11
N$6
  Top 0.305: IC3.20 43.2,33.5 43.85,33.5 IC3.19
N$7
  Top 0.406: X3.L3 5.89,29.03 6.03,29.21 15.56,29.21 | 15.56,29.21 IC2.12 | IC2.13 16.83,27.94 15.56,29.21
N$8  (via drill 0.3)
  Top 0.406: IC2.14 16.51,26.67 v16.19,26.99 15.24,27.94 11.56,27.94 X3.L2 | v16.19,30.48 IC2.11
  Bottom 0.406: v16.19,26.99 v16.19,30.48
N$9  (via drill 0.3)
  Top 0.305: v52.7,44.45 51.65,44.45 | 51.65,44.45 R2.1 | 51.65,44.45 R1.1
  Bottom 0.305: 50.64,9.37 46.67,4.13 29.84,4.13 29.21,3.49 SHAPE1.5V | 50.64,9.37 | 50.64,9.37 51.12,9.84 58.42,9.84 59.05,10.48 59.05,33.02 58.74,33.34 56.2,33.34 52.7,36.83 v52.7,44.45
N$10
  Top 0.508: L1.2 23.77,38.34 31.59,38.34 31.59,39.05 IC1.1
N$11
  Top 0.305: LED1.A R3.1
N$12  (via drill 0.3)
  Top 0.406: 13.55,25.4 12.7,25.4 v12.7,26.67 | 13.55,25.4 15.24,25.4 | 15.24,25.4 IC2.15 | C8.1 13.55,25.4 | 15.24,25.4 C9.1 | 13.55,31.75 12.7,31.75 v12.7,30.48 | 15.24,31.75 IC2.10 | 13.55,31.75 C14.1 | 15.24,31.75 C15.1 | 13.55,31.75 15.24,31.75
  Bottom 0.406: v12.7,26.67 v12.7,30.48
N$13
  Top 0.305: IC1.11 34.09,44.87 | 34.09,44.87 R4.1 | 34.09,44.87 C7.1
N$14
  Top 0.305: 40.64,22.12 R11.1 40.88,22.23 41.27,22.62 43.5,22.62 43.81,22.94 R8.2
  Top 0.406: Q1.1 40.64,22.12
N$15  (via drill 0.3)
  Top 0.305: IC1.7 34.59,37.54 v34.45,37.54 | v34.77,43.81 34.59,43.81 IC1.10
  Bottom 0.305: v34.45,37.54 34.53,37.54 34.77,37.78 v34.77,43.81
N$16  (via drill 0.3)
  Top 0.305: 39.82,10.4 R13.1 | Q3.1 40.8,8.66
  Top 0.406: 39.82,10.4 v40.8,10.4 40.8,8.66 | R10.2 46.89,23.18 v47.94,23.18
  Bottom 0.406: v47.94,23.18 46.75,23.18 46.12,23.18 45.88,23.18 45.56,22.86 45.56,21.91 45.09,21.43 42.78,21.43 42.55,21.19 42.55,16.51 40.8,14.76 v40.8,10.4
N$17  (via drill 0.3)
  Top 0.305: v41.27,16.43 41.2,16.35
  Top 0.406: 41.2,16.35 R12.1 | Q2.1 41.27,15.49 v41.27,16.43 | R9.2 45.09,22.8 45.09,22.46 v44.77,22.15
  Bottom 0.406: v44.77,22.15 42.23,22.15 41.91,21.83 41.91,17.07 v41.27,16.43
OUT_BLUE
  pour Top (isolate 0.508, rank 4, no thermals): 45.4,4.76 47.31,4.76 52.07,11.11 59.69,11.11 59.69,15.56 50.8,15.88 48.42,10.32 45.4,10.32
OUT_GREEN
  pour Top (isolate 0.508, rank 3, no thermals): 45.4,10.64 47.62,10.64 49.85,15.88 59.69,15.88 59.69,19.05 49.53,19.05 47.94,16.35 45.4,16.35
OUT_RED
  pour Top (isolate 0.508, rank 2, no thermals): 45.4,16.99 47.62,16.99 49.05,20.32 59.69,20.32 59.69,22.54 45.72,22.54 45.4,22.23
P2.10/SDA  (via drill 0.3)
  Top 0.305: IC3.5 40.6,27.5 v40.64,27.62 | v41.27,36.04 42.23,36.99 42.23,41.27 42.55,41.59 46.35,41.59 46.99,42.23 X5.7 | 49.79,43.5 R2.2 | 49.79,43.5 50.01,43.34 | v48.9,43.5 49.79,43.5
  Bottom 0.305: v40.64,27.62 40.64,30.8 40.96,31.11 40.96,35.72 v41.27,36.04 | SHAPE1.14 12.45,49.78 13.02,49.21 47.31,49.21 48.26,48.26 48.26,43.5 47.94,43.18 | 47.94,43.18 X5.7 | v48.9,43.5 48.74,43.18 47.94,43.18
P2.11/SCL  (via drill 0.3)
  Top 0.305: IC3.6 41.25,27.96 v41.43,28.1 | v41.59,35.24 42.23,35.88 42.23,36.04 42.86,36.67 42.86,40.64 43.18,40.96 46.67,40.96 48.26,42.55 48.26,45.72 | R1.2 49.31,45.72 48.26,45.72 | X5.8 48.26,45.72
  Bottom 0.305: v41.43,28.1 41.43,30.64 41.59,30.8 v41.59,35.24 | SHAPE1.15 9.91,49.47 10.79,48.58 46.35,48.58 46.99,47.94 X5.8
SHIELD
  Top 0.406: 14.92,24.13 13.55,24.13 C8.2 13.12,24.13 13.34,24.13 13.11,24.03 X3.L1 | 14.92,24.13 IC2.16 | C9.2 15.14,23.91 14.92,24.13 | 15.24,33.02 13.55,33.02 C14.2 | 15.24,33.02 IC2.9 | 15.24,33.02 C15.2
  pour Top (isolate 0.406, no thermals): 13.34,34.29 13.34,22.86 0,22.86 0,34.29
  pour Bottom (isolate 0.406, no thermals): 19.05,34.29 19.05,22.86 -1.27,22.86 -1.27,34.29
SWD/(SPD)
  Top 0.254: X4.2 45.09,37.78 44.77,37.47 44.77,36.83 41.25,33.31 IC3.23
  Bottom 0.406: X4.2 45.4,38.1 38.73,38.1 38.1,38.73 38.1,45.09 38.73,45.72 X5.2
SWDCLK
  Top 0.254: X4.4 46.35,38.73 44.93,38.73 44.29,38.1 44.29,36.99 42.86,35.56 | 42.86,35.56 40.6,33.3 IC3.24 | 42.86,35.56
  Bottom 0.406: X5.1 39.05,43.18 38.73,42.86 38.73,39.37 39.37,38.73 46.35,38.73 X4.4
VCC  (via drill 0.3)
  Top 0.305: IC3.8 42.55,24.77 C17.1 | IC2.7 29.21,31.75 29.53,31.43 30.16,31.43 | 30.16,31.43 32.07,31.43 C13.1 32.07,30.96 v33.18,30.96 33.18,26.25 | 30.16,31.43 C12.1 | IC2.2 29.21,25.4 29.53,25.72 30.16,25.72 | 30.16,25.72 32.07,25.72 C11.1 33.18,26.25 | 30.16,25.72 C10.1 | v51.75,33.34 R7.1 | IC1.9 35.09,43.18 35.4,43.5 v35.56,43.5 | v30.56,46.2 30.16,46.04 | v33.02,25.4 33.18,25.56 33.18,26.25 | R3.2 2.44,6.13 v2.38,6.19
  Top 0.406: v43.1,23.97 42.12,23.97
  Top 0.813: C16.1 42.12,23.97 C17.1
  Bottom 0.305: v33.18,30.96 | v33.18,30.96 33.66,31.43 | v2.38,6.19 2.38,11.11 2.7,11.43 26.35,11.43 26.67,11.75 26.67,24.77 26.99,25.08 32.7,25.08 v33.02,25.4
  Bottom 0.406: X5.3 X5.6 43.18,46.99 37.78,46.99 37.47,46.67 | 38.42,37.47 44.45,37.47 45.4,36.51 X4.1 45.72,35.08 46.83,33.97 50.96,33.97 v51.75,33.34 51.75,24.77 43.89,24.77 v43.1,23.97 | v33.18,30.96 33.5,31.27 | v35.56,43.5 35.56,45.48 34.85,46.2 v30.56,46.2 30.56,46.75 30.8,46.99 37.15,46.99 37.47,46.67 | 33.66,31.43 33.66,32.7 38.42,37.47 | 38.42,37.47 38.1,37.47 37.47,38.1 37.47,46.67
  pour Top (isolate 0.305, no thermals): 21.27,41.27 25.72,41.27 25.72,43.81 30.8,43.81 30.8,46.99 25.08,46.99 21.27,43.18
VDD  (via drill 0.3)
  Top 0.406: C3.1 31.56,37.02 v32.07,36.83
  Bottom 0.61: v32.07,36.83 26.99,36.83 25.72,35.56 v25.72,14.92 v25.08,14.92
  other vias: 31.11,5.56 30.32,5.56 30.32,6.35 31.11,6.35 31.11,7.14 30.32,7.14 31.11,11.91 30.32,11.91 30.32,12.7 31.11,12.7 31.11,13.49 30.32,13.49 31.11,18.57 30.32,18.57 30.32,19.37 31.11,19.37 31.11,20.16 30.32,20.16 31.43,36.83
  pour Top (isolate 0.508, rank 5, no thermals): 0,18.41 23.81,18.41 26.04,20.95 33.34,20.95 33.34,5.08 29.84,5.08 29.84,10.79 0,12.06
  pour Bottom (isolate 0.508, rank 3, no thermals): 29.84,20.95 34.29,25.08 45.4,25.08 46.35,26.04 59.05,26.04 59.69,11.11 50.8,11.11 46.04,4.76 29.84,4.76
  pour Top (isolate 0.305, no thermals): 26.67,37.62 31.91,37.62 32.54,38.1 32.54,39.05 32.7,39.05 32.7,35.56 26.67,35.56
VREF_BLUE
  Top 0.305: IC3.27 38.65,33.1 37.47,34.29 37.47,36.51 37.68,36.73 R19.1 38.42,37.15 38.73,37.47 39.95,37.47 C23.1
VREF_GREEN
  Top 0.305: R18.1 35.14,31.96 34.92,31.75 34.92,29.21 35.24,28.89 | 35.24,28.89 35.77,28.89 C22.1 | IC3.1 38,26.25 37.78,26.04 35.24,26.04 34.92,26.35 34.92,28.57 35.24,28.89
VREF_RED
  Top 0.305: 50.06,28.89 50.06,28.57 46.67,28.57 46.51,28.73 41.12,28.73 39.3,27.4 IC3.3
  Top 0.406: R17.1 50.06,28.89 C21.1

### Text on the board
Bottom: Infineon Technologies | 2014/17
Text: SCL | SDA | GND | GND | 5V | SD | P2.11 | SC | 5V | GND | P2.10 | DEBUG | RGB LED shield | with XMC1202 | IN- | isolated | IN+ | SHIELD | DMX512 | OUT | led+ | red | green | blue | DC IN | VDC+ | VDC- | ON | I2C pull-up